# EAGLE schematic MEMS-preamp_v08 (EAGLE 8.6.1)
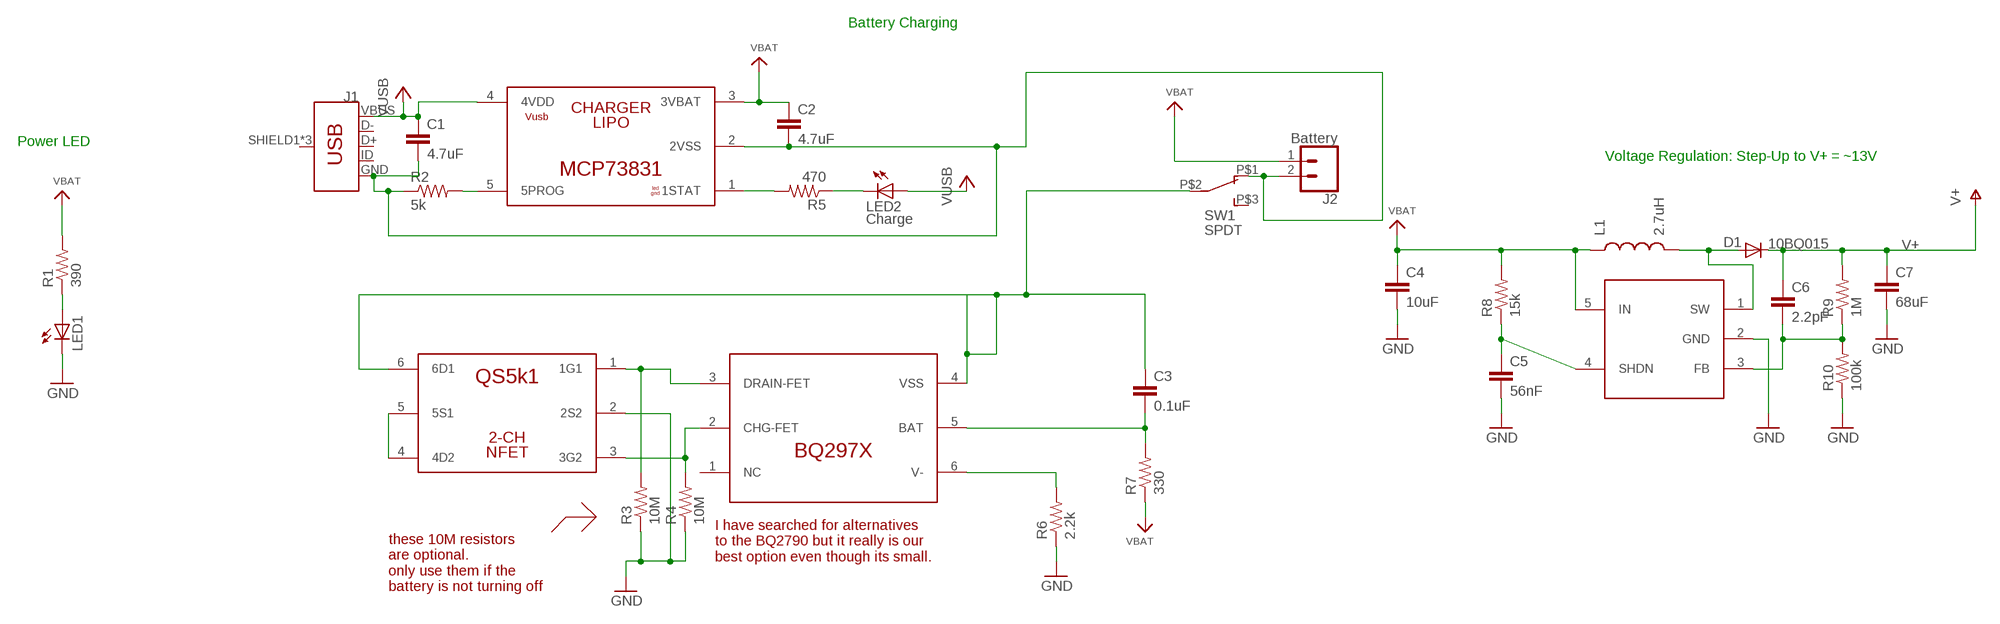
[diagram p0: schematic, sheet 1, part 1 of 2]
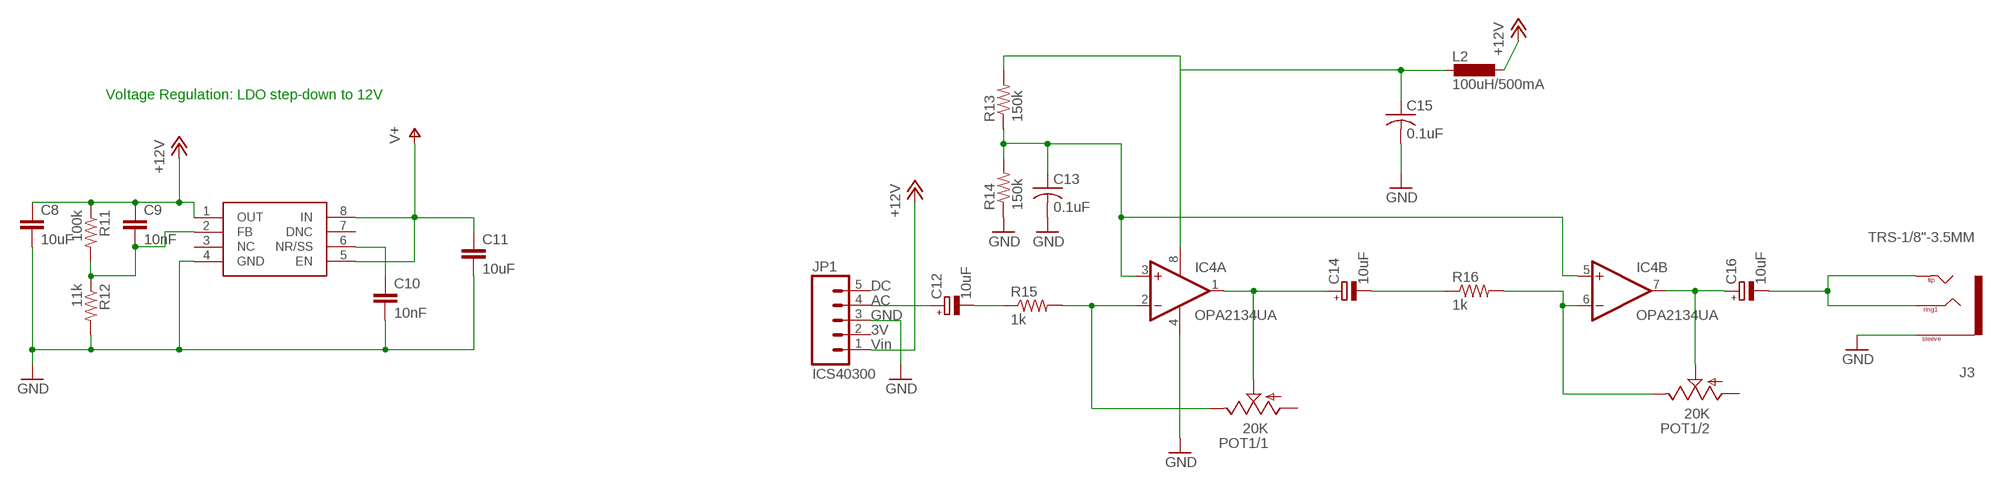
[diagram p1: schematic, sheet 1, part 2 of 2]

## Parts
C1  4.7uF  C-EUC0603  [C0603]
C2  4.7uF  C-EUC0603  [C0603]
C3  0.1uF  C-EUC0603  [C0603]
C4  10uF  C-EUC0603  [C0603]
C5  56nF  C-EUC0603  [C0603]
C6  2.2pF  C-EUC0603  [C0603]
C7  68uF  C-EUC1206  [C1206]
C8  10uF  C-EUC0603  [C0603]
C9  10nF  C-EUC0603  [C0603]
C10  10nF  C-EUC0603  [C0603]
C11  10uF  C-EUC0603  [C0603]
C12  10uF  CPOL-EUB  [PANASONIC_B]
C13  0.1uF  C-USC0805  [C0805]
C14  10uF  CPOL-EUB  [PANASONIC_B]
C15  0.1uF  C-USC0805K  [C0805K]
C16  10uF  CPOL-EUB  [PANASONIC_B]
D1  10BQ015  DIODESMA  [SMA-DIODE]
IC1  BQ297X  BQ297X-BATTERY-MANAGERLONG  [WSON-6-LONG]
IC2  SC4503  [SOT23-5]
IC3  TPS7A49  [MSOP-8]
IC4  OPA2134UA  [SO08]
J1  USB_MICRO-BREDUCED_PASTE  [USB-B-MICRO-SMD_RED_PASTE]
J2  Battery  CONN_02LOCK  [1X02_LOCK]
J3  TRS-1/8"-3.5MM  [TRS_SJ-3524-SMT]
JP1  ICS40300  M05LOCK  [1X05_LOCK]
L1  2.7uH  INDUCTORCR54  [CR54]
L2  100uH/500mA  L-EUL3225M  [L3225M]
LED1  LED3MM  [LED3MM]
LED2  Charge  LED3MM  [LED3MM]
POT1  20K  POT-DUAL-PTV112-4420  [PTV112]
R1  390  R-US_R0603  [R0603]
R2  5k  R-US_R0603  [R0603]
R3  10M  R-US_R0603  [R0603]
R4  10M  R-US_R0603  [R0603]
R5  470  R-US_R0603  [R0603]
R6  2.2k  R-US_R0603  [R0603]
R7  330  R-US_R0603  [R0603]
R8  15k  R-US_R0603  [R0603]
R9  1M  R-US_R0603  [R0603]
R10  100k  R-US_R0603  [R0603]
R11  100k  R-US_R0603  [R0603]
R12  11k  R-US_R0603  [R0603]
R13  150k  R-US_R0603  [R0603]
R14  150k  R-US_R0603  [R0603]
R15  1k  R-US_R0603  [R0603]
R16  1k  R-US_R0603  [R0603]
SW1  SPDT  SWITCH_SPDTCL-SB-12B  [SWITCH_SPDT_CL-SB-12B]
U2  QS6K1  [SOT457R_PHILIPS]
U3  MCP73831  [SOT-23-5]

## Nets
+5V: C1.1 J1.VBUS LED2.A U3.4(4VDD) ; supply symbol labelled VUSB
+12V: C8.1 C9.1 IC3.1(OUT) JP1.1 L2.1 R11.1
BATGND: C3.1 IC1.4(VSS) SW1.P$2 U2.6(6D1)
GND: C4.2 C5.2 C7.2 C8.2 C10.2 C11.2 C13.2 C15.2 IC2.2(GND) IC3.4(GND) IC4.4(A:V-) J3.1(SLEEVE) JP1.3 LED1.K(C) R3.1 R4.1 R6.1 R10.1 R12.2 R14.1 U2.2(2S2)
N$2: LED1.A R1.1
N$3: C12.+ JP1.4
N$4: C14.- R16.1
N$5: IC4.2(A:-IN) POT1.1.3(/1:E) R15.2
N$6: R2.2 U3.5(5PROG)
N$7: C16.- J3.2(TIP) J3.3(RING1) J3.4(TIP)
N$8: C13.1 IC4.3(A:+IN) IC4.5(B:+IN) R13.1 R14.2
N$9: C14.+ IC4.1(A:OUT) POT1.1.2(/1:S)
N$10: C16.+ IC4.7(B:OUT) POT1.2.2(/2:S)
N$11: U2.4(4D2) U2.5(5S1)
N$12: D1.A IC2.1(SW) L1.P$2
N$13: C5.1 IC2.4(SHDN) R8.1
N$14: C6.2 IC2.3(FB) R9.1 R10.2
N$15: C15.1 IC4.8(A:V+) L2.2 R13.2
N$21: IC4.6(B:-IN) POT1.2.3(/2:E) R16.2
N$22: LED2.K(C) R5.1
N$23: C12.- R15.1
N$25: R5.2 U3.1(1STAT)
N$27: IC1.3(DRAIN-FET) R3.2 U2.1(1G1)
N$31: IC1.2(CHG-FET) R4.2 U2.3(3G2)
N$34: IC1.6(V-) R6.2
N$42: C3.2 IC1.5(BAT) R7.2
N$47: C9.2 IC3.2(FB) R11.2 R12.1
N$48: C10.1 IC3.6(NR/SS)
USBGND: C1.2 C2.2 J1.GND J2.2 R2.1 SW1.P$1 U3.2(2VSS)
V+: C6.1 C7.1 C11.1 D1.C IC3.5(EN) IC3.8(IN) R9.2
VBAT: C2.1 C4.1 IC2.5(IN) J2.1 L1.P$1 R1.2 R7.1 R8.2 U3.3(3VBAT)
Unconnected: IC1.1(NC) IC3.3(NC) IC3.7(DNC) J1.D+ J1.D- J1.ID J1.SHIELD1(SHIELD) J1.SHIELD2(SHIELD) J1.SHIELD3(SHIELD) JP1.2 JP1.5 POT1.1.1(/1:A) POT1.2.1(/2:A) SW1.P$3

## Notes on the sheet
- Battery Charging
- Power LED
- Voltage Regulation: Step-Up to V+ = ~13V | Voltage Regulation: LDO step-down to 12V
- I have searched for alternatives 
  to the BQ2790 but it really is our 
  best option even though its small.
- these 10M resistors
  are optional. 
  only use them if the 
  battery is not turning off

## Library data of the parts
C1-C11 = rcl:C-EU: CAPACITOR, European symbol; SPICEPREFIX: C
C12 C14 C16 = resistor:CPOL-EU: POLARIZED CAPACITOR, European symbol
C13 C15 = adafruit:C-US: CAPACITOR, American symbol
D1 = SparkFun:DIODE: Diode These are standard reverse protection diodes and small signal diodes. SMA package can handle up to about 1A. SOD-323 can handle about 200mA. What the SOD-323 package when ordering, there are some mfgs out there that are 5-pin packages.
IC1 = CMU-ArtFab:BQ297X-BATTERY-MANAGER
IC2 = CMU-ArtFab:SC4503
IC3 = CMU-ArtFab:TPS7A49
IC4 = linear:OPA2*: Dual Operational Amplifier Low Power, Single-Supply, Rail-To-Rail Operational Amplifier Source: http://focus.ti.com/lit/ds/symlink/opa2345.pdf http://focus.ti.com .. opa241.pdf http://focus.ti.com/lit/ds/symlink/opa2134.pdf
J1 = CMU-ArtFab:USB_MICRO-B: USB Type Micro-B Connector Male/female and PTH/SMT variants SparkFun Products: SparkFun microB USB Breakout <https://www.sparkfun.com/products/12035> SparkFun USB microB Plug Breakout <https://www.sparkfun.com/products/10031> SparkFun ESP8266 Thing <https://www.sparkfun.com/products/13231>; PROD_ID: CONN-11752
J2 = SparkFun-Connectors:CONN_02: Multi connection point. Often used as Generic Header-pin footprint for 0.1 inch spaced/style header connections On any of the 0.1 inch spaced packages, you can populate with these: Break Away Headers - Straight <https://www.sparkfun.com/products/116> (PRT-00116) Break Away Male Headers - Right Angle <https://www.sparkfun.com/products/553> (PRT-00553) Female Headers <https://www.sparkfun.com/products/115> (PRT-00115) Break Away Headers - Machine Pin <https://www.sparkfun.com/products/117> (PRT-00117) Break Away Female Headers - Swiss Machine Pin <https://www.sparkfun.com/products/743> (PRT-00743) For SCREWTERMINALS and SPRING TERMINALS visit here: Screw Terimnals on SparkFun.com <https://www.sparkfun.com/search/results?term=Screw+Terminals> (5mm/3.5mm/2.54mm spacing) This device is also useful as a general connection point to wire up your design to another part of your project. Our various solder wires solder well into these plated through hole pads. Hook-Up Wire - Assortment (Stranded, 22 AWG) <https://www.sparkfun.com/products/11375> (PRT-11375) Hook-Up Wire - Assortment (Solid Core, 22 AWG) <https://www.sparkfun.com/products/11367> (PRT-11367) View the entire wire category on our website here <https://www.sparkfun.com/categories/141> Special notes: Molex polarized connector foot print use with: PRT-08233 with associated crimp pins and housings. 2.54_SCREWTERM for use with PRT-10571. 3.5mm Screw Terminal footprints for PRT-08084 5mm Screw Terminal footprints for use with PRT-08432
J3 = CMU-ArtFab:TRS-1/8"-3.5MM
JP1 = SparkFun-Connectors:M05: Header 5 Standard 5-pin 0.1" header. Use with straight break away headers (SKU : PRT-00116), right angle break away headers (PRT-00553), swiss pins (PRT-00743), machine pins (PRT-00117), and female headers (PRT-00115). Molex polarized connector foot print use with SKU : PRT-08230 with associated crimp pins and housings.; CON1: Vin; CON2: 3V; CON3: GND; CON4: AC; CON5: DC
L1 = SparkFun-Passives:INDUCTOR: Inductors Basic Inductor/Choke - 0603 and 1206. Footprints are not proven and vary greatly between part numbers. SRN6045- 33uH, 20% 1.4A SDR0403-560KL - 56uH, 10%, 500mA RMS/740mA peak
L2 = rcl:L-EU: INDUCTOR, European symbol; SPICEPREFIX: L
LED1 LED2 = led:LED: LED OSRAM: - CHIPLED LG R971, LG N971, LY N971, LG Q971, LY Q971, LO R971, LY R971 LH N974, LH R974 LS Q976, LO Q976, LY Q976 LO Q996 - Hyper CHIPLED LW Q18S LB Q993, LB Q99A, LB R99A - SideLED LS A670, LO A670, LY A670, LG A670, LP A670 LB A673, LV A673, LT A673, LW A673 LH A674 LY A675 LS A676, LA A676, LO A676, LY A676, LW A676 LS A679, LY A679, LG A679 - Hyper Micro SIDELED® LS Y876, LA Y876, LO Y876, LY Y876 LT Y87S - SmartLED LW L88C, LW L88S LB L89C, LB L89S, LG L890 LS L89K, LO L89K, LY L89K LS L896, LA L896, LO L896, LY L896 - TOPLED LS T670, LO T670, LY T670, LG T670, LP T670 LSG T670, LSP T670, LSY T670, LOP T670, LYG T670 LG T671, LOG T671, LSG T671 LB T673, LV T673, LT T673, LW T673 LH T674 LS T676, LA T676, LO T676, LY T676, LB T676, LH T676, LSB T676, LW T676 LB T67C, LV T67C, LT T67C, LS T67K, LO T67K, LY T67K, LW E67C LS E67B, LA E67B, LO E67B, LY E67B, LB E67C, LV E67C, LT E67C LW T67C LS T679, LY T679, LG T679 LS T770, LO T770, LY T770, LG T770, LP T770 LB T773, LV T773, LT T773, LW T773 LH T774 LS E675, LA E675, LY E675, LS T675 LS T776, LA T776, LO T776, LY T776, LB T776 LHGB T686 LT T68C, LB T68C - Hyper Mini TOPLED® LB M676 - Mini TOPLED Santana® LG M470 LS M47K, LO M47K, LY M47K Source: http://www.osram.convergy.de LUXEON: - LUMILED® LXK2-PW12-R00, LXK2-PW12-S00, LXK2-PW14-U00, LXK2-PW14-V00 LXK2-PM12-R00, LXK2-PM12-S00, LXK2-PM14-U00 LXK2-PE12-Q00, LXK2-PE12-R00, LXK2-PE12-S00, LXK2-PE14-T00, LXK2-PE14-U00 LXK2-PB12-K00, LXK2-PB12-L00, LXK2-PB12-M00, LXK2-PB14-N00, LXK2-PB14-P00, LXK2-PB14-Q00 LXK2-PR12-L00, LXK2-PR12-M00, LXK2-PR14-Q00, LXK2-PR14-R00 LXK2-PD12-Q00, LXK2-PD12-R00, LXK2-PD12-S00 LXK2-PH12-R00, LXK2-PH12-S00 LXK2-PL12-P00, LXK2-PL12-Q00, LXK2-PL12-R00 Source: www.luxeon.com KINGBRIGHT: KA-3528ASYC Source: www.kingbright.com
POT1 = CMU-ArtFab:POT-DUAL-PTV112: Bourns 11mm dual potentiometer; AVAILABILITY: Unavailable; DESCRIPTION: Alt# Tce-10111410; MF: STMicroelectronics; MP: PTV112; PACKAGE: None; PRICE: None
R1-R16 = CMU-ArtFab:R-US_: RESISTOR, American symbol
SW1 = CMU-ArtFab:SWITCH_SPDT
U2 = CMU-ArtFab:QS6K1
U3 = CMU-ArtFab:MCP73831